# Altium project горизонтальная плата для системы со светодиодами.PrjPcb
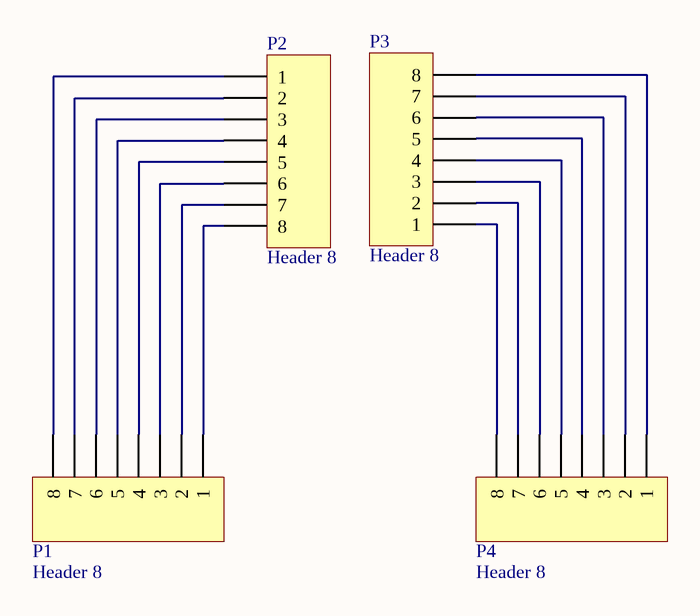
[diagram p0: Sheet1.SchDoc]
1 sheet, 4 parts. Net scope: global (net labels, ports and power ports of the same name join across sheets).
Board file: PCB1.PcbDoc

## Sheet Sheet1.SchDoc
size A4; SheetNumber: 1; SheetTotal: 1

### Parts
P1  Header 8  [HDR1X8]
P2  Header 8  [HDR1X8]
P3  Header 8  [HDR1X8]
P4  Header 8  [HDR1X8]

### Nets
NetP1_1: P1.1 P2.8
NetP1_2: P1.2 P2.7
NetP1_3: P1.3 P2.6
NetP1_4: P1.4 P2.5
NetP1_5: P1.5 P2.4
NetP1_6: P1.6 P2.3
NetP1_7: P1.7 P2.2
NetP1_8: P1.8 P2.1
NetP3_1: P3.1 P4.8
NetP3_2: P3.2 P4.7
NetP3_3: P3.3 P4.6
NetP3_4: P3.4 P4.5
NetP3_5: P3.5 P4.4
NetP3_6: P3.6 P4.3
NetP3_7: P3.7 P4.2
NetP3_8: P3.8 P4.1

### Library data of the parts
P1-P4 = Header 8: Header, 8-Pin; LatestRevisionDate: 17-Jul-2002; LatestRevisionNote: Re-released for DXP Platform.; Publisher: Altium Limited